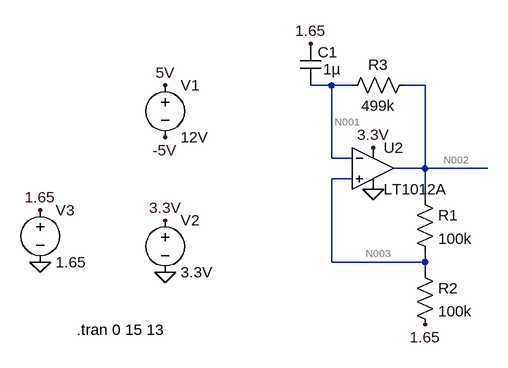
[diagram p0: schematic mini_project_1.asc]
mini_project_1.asc, the LTspice schematic file:
Version 4
SHEET 1 880 680
WIRE -80 -176 -112 -176
WIRE -48 -176 -80 -176
WIRE 64 -176 32 -176
WIRE -80 -64 -80 -176
WIRE -48 -64 -80 -64
WIRE 64 -48 64 -176
WIRE 64 -48 16 -48
WIRE 160 -48 64 -48
WIRE -48 -32 -80 -32
WIRE 64 0 64 -48
WIRE -80 96 -80 -32
WIRE 64 96 64 80
WIRE 64 96 -80 96
WIRE 64 112 64 96
FLAG -336 -176 5V
FLAG -336 32 3.3V
FLAG -336 112 0
FLAG -336 -96 -5V
FLAG -16 -16 0
FLAG -528 16 1.65
FLAG -528 96 0
FLAG 64 192 1.65
FLAG -112 -240 1.65
FLAG -16 -80 3.3V
SYMBOL res 48 -16 R0
SYMATTR InstName R1
SYMATTR Value 100k
SYMBOL res 48 96 R0
SYMATTR InstName R2
SYMATTR Value 100k
SYMBOL res 48 -192 R90
WINDOW 0 0 56 VBottom 2
WINDOW 3 32 56 VTop 2
SYMATTR InstName R3
SYMATTR Value 499k
SYMBOL cap -128 -240 R0
WINDOW 0 27 13 Left 2
WINDOW 3 35 39 Left 2
SYMATTR InstName C1
SYMATTR Value 1µ
SYMBOL voltage -336 -192 R0
SYMATTR InstName V1
SYMATTR Value 12V
SYMBOL voltage -336 16 R0
SYMATTR InstName V2
SYMATTR Value 3.3V
SYMBOL OpAmps\\LT1012A -16 -112 R0
SYMATTR InstName U2
SYMBOL voltage -528 0 R0
SYMATTR InstName V3
SYMATTR Value 1.65
TEXT -472 200 Left 2 !.tran 0 15 13

The netlist it stands for:
* mini_project_1.asc
R1 N002 N003 100k
R2 N003 1.65 100k
R3 N002 N001 499k
C1 1.65 N001 1µ
V1 5V -5V 12V
V2 3.3V 0 3.3V
XU2 N003 N001 3.3V 0 N002 LT1012A  ; pins In+ In- V+ V- OUT
V3 1.65 0 1.65
.tran 0 15 13
.backanno
.end

* Results of the author's LTspice run, read from the files saved beside the schematic
* Operating Point, zero values left out:
*   V(n002) = 1.65 V
*   V(n003) = 1.65 V
*   V(1.65) = 1.65 V
*   V(n001) = 1.65 V
*   V(5v) = 12 V
*   V(3.3v) = 3.3 V
*   I(V2) = -380 µA
*   Ix(u2:3) = 380 µA
*   Ix(u2:4) = -380 µA
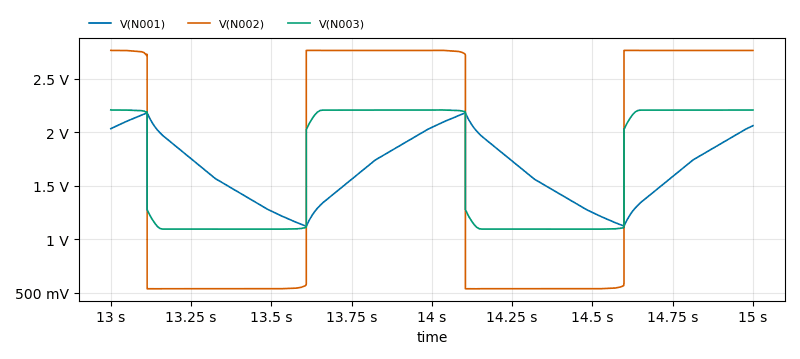
[diagram p1: Transient Analysis of mini_project_1.asc, plotted from the saved traces]
* Transient Analysis, 1 run:
*   V(N001): min 1.12 V, max 2.18 V, average 1.654 V, rms 1.687 V, last 2.06 V
*   V(N002): min 536.1 mV, max 2.764 V, average 1.661 V, rms 1.999 V, last 2.763 V
*   V(N003): min 1.094 V, max 2.208 V, average 1.656 V, rms 1.744 V, last 2.206 V